# Altium schematic sheet TopSheet.SchDoc
size A4; CompanyName: Technische Hochschule Nürnberg Georg Simon Ohm; Organization: UltraZohm; Address1: Kesslerplatz 12; Address2: 90489 Nürnberg; Address3: GERMANY; DocumentNumber: 1; SheetNumber: 1; SheetTotal: 6; Website: www.ultrazohm.com
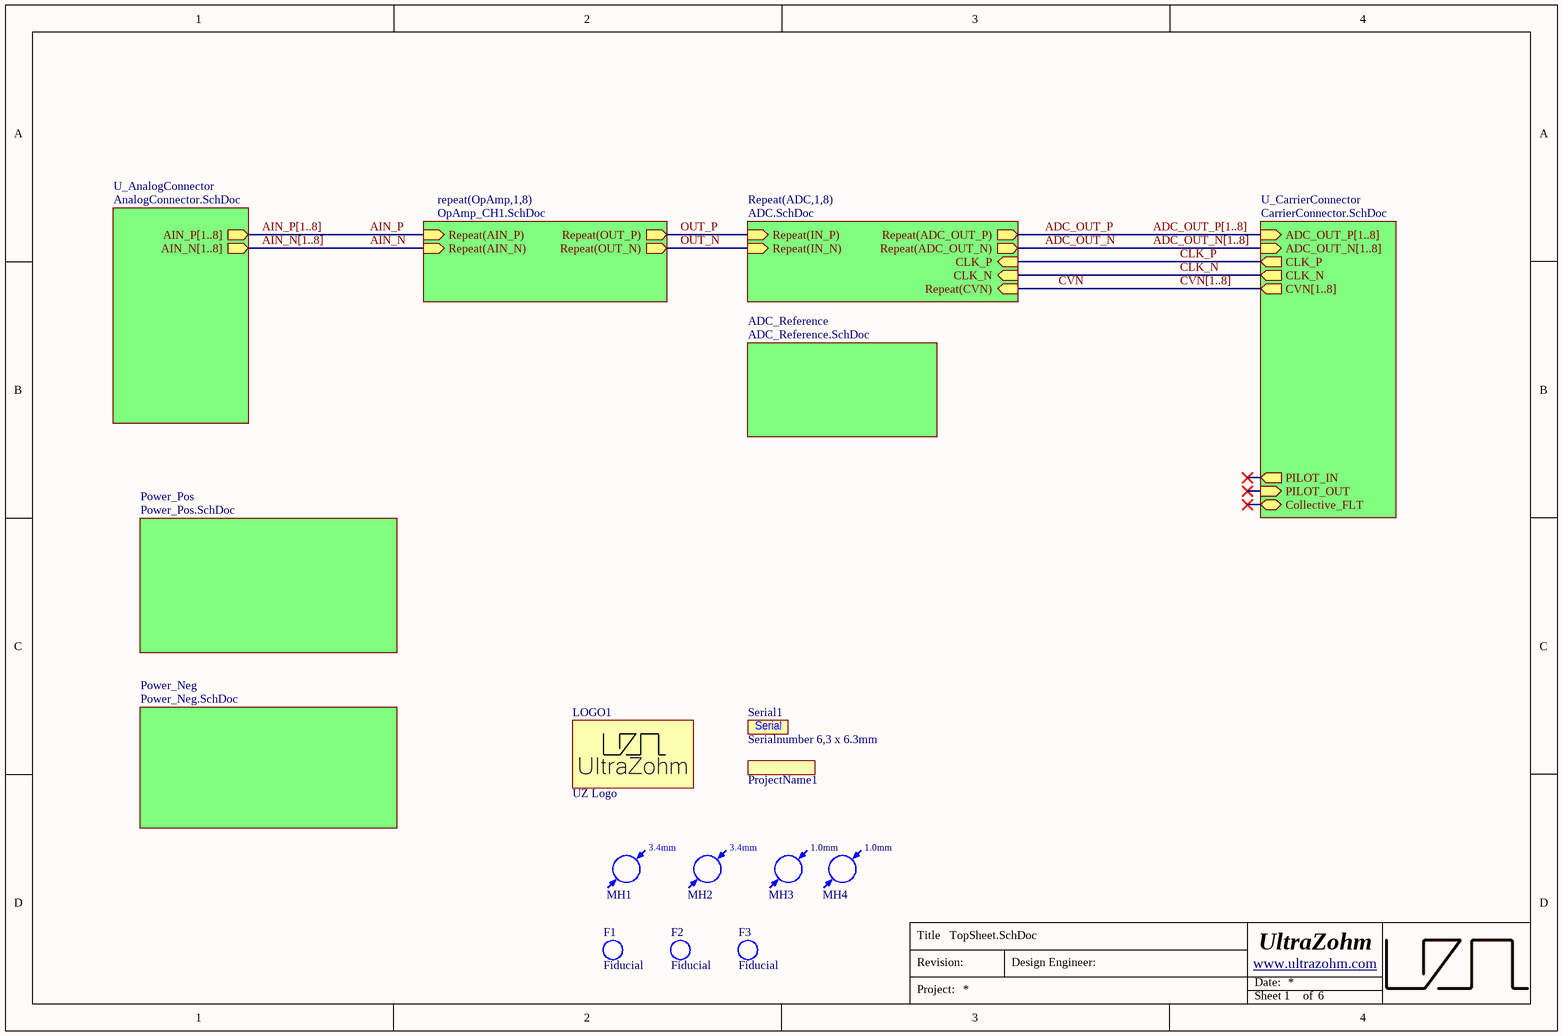
[diagram p0: TopSheet.SchDoc]

## Parts
F1  Fiducial  [Fiducial_1.7mm]  (no BOM)
F2  Fiducial  [Fiducial_1.7mm]  (no BOM)
F3  Fiducial  [Fiducial_1.7mm]  (no BOM)
LOGO1  UZ Logo  [UZ_Logo_tiny]  (no BOM)
MH1  mounting hole 3,4mm  [MH_3.4]  (value not drawn)  (no BOM)
MH2  mounting hole 3,4mm  [MH_3.4]  (value not drawn)  (no BOM)
MH3  alignment hole 1mm  [MH_1]  (value not drawn)
MH4  alignment hole 1mm  [MH_1]  (value not drawn)
ProjectName1  Project Name, Rev  [ID_ProjectRev]  (value not drawn)  (no BOM)
Serial1  Serialnumber 6,3 x 6.3mm  [Serial_6.3x6.3mm]  (no BOM)

## Sub-sheets
ADC_Reference = ADC_Reference.SchDoc: no entries
Power_Neg = Power_Neg.SchDoc: no entries
Power_Pos = Power_Pos.SchDoc: no entries
Repeat(ADC,1,8) = ADC.SchDoc: Repeat(CVN) (in), Repeat(ADC_OUT_N) (out), Repeat(ADC_OUT_P) (out), Repeat(IN_N) (in), CLK_P (in), CLK_N (in), Repeat(IN_P) (in)
repeat(OpAmp,1,8) = OpAmp_CH1.SchDoc: Repeat(AIN_P) (in), Repeat(AIN_N) (in), Repeat(OUT_P) (out), Repeat(OUT_N) (out)
U_AnalogConnector = AnalogConnector.SchDoc: AIN_P[1..8] (out), AIN_N[1..8] (out)
U_CarrierConnector = CarrierConnector.SchDoc: PILOT_OUT (in), PILOT_IN (out), Collective_FLT (bidir), CLK_P (out), CLK_N (out), ADC_OUT_P[1..8] (in), ADC_OUT_N[1..8] (in), CVN[1..8] (out)

## Nets
ADC_OUT_N: sheet Repeat(ADC,1,8)/Repeat(ADC_OUT_N)
ADC_OUT_P: sheet Repeat(ADC,1,8)/Repeat(ADC_OUT_P)
AIN_N: sheet repeat(OpAmp,1,8)/Repeat(AIN_N)
AIN_P: sheet repeat(OpAmp,1,8)/Repeat(AIN_P)
CLK_N: sheet U_CarrierConnector/CLK_N, sheet Repeat(ADC,1,8)/CLK_N
CLK_P: sheet U_CarrierConnector/CLK_P, sheet Repeat(ADC,1,8)/CLK_P
CVN: sheet Repeat(ADC,1,8)/Repeat(CVN)
OUT_N: sheet Repeat(ADC,1,8)/Repeat(IN_N), sheet repeat(OpAmp,1,8)/Repeat(OUT_N)
OUT_P: sheet Repeat(ADC,1,8)/Repeat(IN_P), sheet repeat(OpAmp,1,8)/Repeat(OUT_P)

## Buses and harness runs
bus ADC_OUT_N[1..8] = sheet U_CarrierConnector/ADC_OUT_N[1..8]
bus ADC_OUT_P[1..8] = sheet U_CarrierConnector/ADC_OUT_P[1..8]
bus AIN_N[1..8] = sheet U_AnalogConnector/AIN_N[1..8]
bus AIN_P[1..8] = sheet U_AnalogConnector/AIN_P[1..8]
bus CVN[1..8] = sheet U_CarrierConnector/CVN[1..8]

## Notes on the sheet
- Title
- Revision:
- Design Engineer:
- Date:
- Project:
- Sheet
- of
- (in symbol Mounting Hole) 3.4mm
- (in symbol Mounting Hole - 1mm) 1.0mm
- (in symbol SerialNumber) Serial

## Library data of the parts
F1-F3 = Fiducial: Fiducial for Assembler
LOGO1 = UZ Logo: UltraZohm Logo on PCB; Created: Jan2021_Liegmann; Value: UZ Logo
MH1 MH2 = Mounting Hole: Non plated through hole, 3.4mm
MH3 MH4 = Mounting Hole - 1mm: Non plated through hole, 1mm
ProjectName1 = ID_ProjectRev: Project Name and Revision Number; Created: 2018_11_23_AGeiger; Value: Project Name, Rev
Serial1 = SerialNumber: Created: 2018_09_18_AGeiger; Value: Serialnumber 6,3 x 6.3mm